# Altium schematic sheet Processing-Section.SchDoc
size A4; DocumentNumber: 2; SheetNumber: 2; SheetTotal: 8
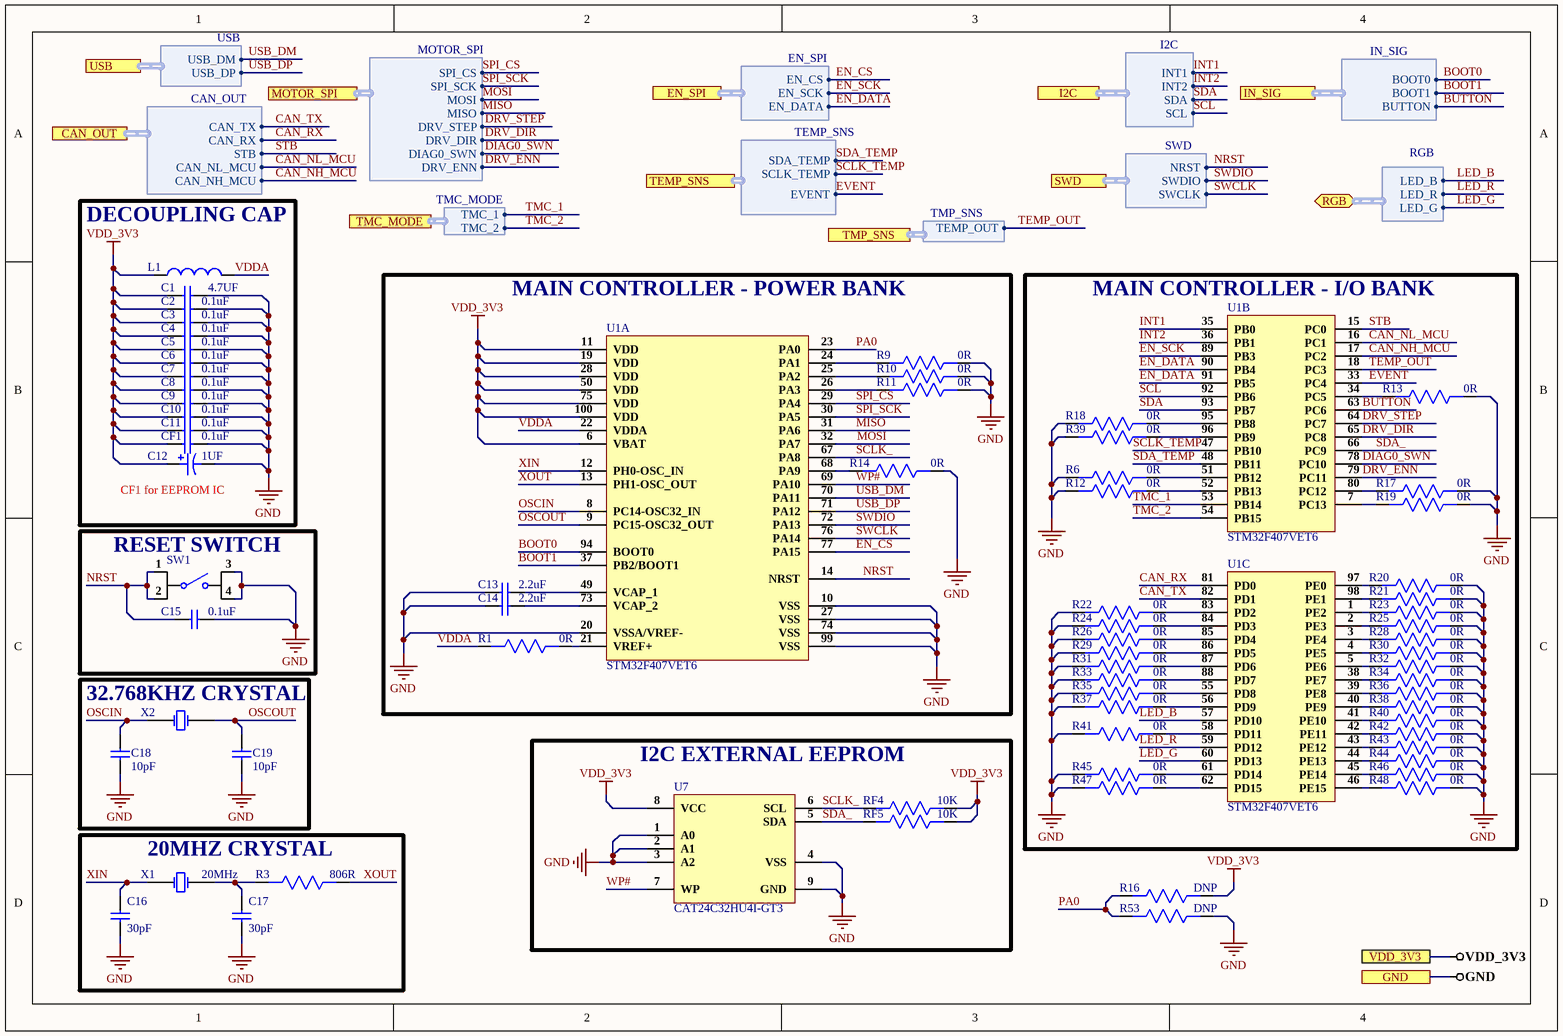
[diagram p0: Processing-Section.SchDoc]

## Parts
C1  4.7UF  [Cap0603]
C2  0.1uF  [Cap0603]
C3  0.1uF  [Cap0603]
C4  0.1uF  [Cap0603]
C5  0.1uF  [Cap0603]
C6  0.1uF  [Cap0603]
C7  0.1uF  [Cap0603]
C8  0.1uF  [Cap0603]
C9  0.1uF  [Cap0603]
C10  0.1uF  [Cap0603]
C11  0.1uF  [Cap0603]
C12  1UF  [CAP-CASE A]
C13  2.2uF  [Cap 0603]
C14  2.2uF  [Cap 0603]
C15  0.1uF  [Cap0603]
C16  30pF  [Cap 0603]
C17  30pF  [Cap 0603]
C18  10pF  [CAP 0201]
C19  10pF  [CAP 0201]
CF1  0.1uF  [Cap 0603]
L1  FBMH1608HL121-TV  [IND 0603]  (value not drawn)
R1  0R  [Res-0201]
R3  806R  [Res-0201]
R6  0R  [Res-0201]
R9  0R  [Res-0201]
R10  0R  [Res-0201]
R11  0R  [Res-0201]
R12  0R  [Res-0201]
R13  0R  [Res-0201]
R14  0R  [Res-0201]
R16  DNP  [Res0603]
R17  0R  [Res-0201]
R18  0R  [Res-0201]
R19  0R  [Res-0201]
R20  0R  [Res-0201]
R21  0R  [Res-0201]
R22  0R  [Res-0201]
R23  0R  [Res-0201]
R24  0R  [Res-0201]
R25  0R  [Res-0201]
R26  0R  [Res-0201]
R28  0R  [Res-0201]
R29  0R  [Res-0201]
R30  0R  [Res-0201]
R31  0R  [Res-0201]
R32  0R  [Res-0201]
R33  0R  [Res-0201]
R34  0R  [Res-0201]
R35  0R  [Res-0201]
R36  0R  [Res-0201]
R37  0R  [Res-0201]
R38  0R  [Res-0201]
R39  0R  [Res-0201]
R40  0R  [Res-0201]
R41  0R  [Res-0201]
R42  0R  [Res-0201]
R43  0R  [Res-0201]
R44  0R  [Res-0201]
R45  0R  [Res-0201]
R46  0R  [Res-0201]
R47  0R  [Res-0201]
R48  0R  [Res-0201]
R53  DNP  [Res0603]
RF4  10K  [Res0603]
RF5  10K  [Res0603]
SW1  GT-TC025D-H0065-L1  [GT-TC025D-H0065-L1]  (value not drawn)
U1  STM32F407VET6  [LQFP-100]  (parts A,B,C of 3)
U7  CAT24C32HU4I-GT3  [8-UDFN-EP (2x3)]
X1  20MHz  [HCM4920000000ABJT]
X2  ECS-.327-7-34B-C-TR  [ECS-.327-7-34B-C-TR]  (value not drawn)

## Blocks framed on the sheet
DECOUPLING CAP: C1-C12 CF1 L1
MAIN CONTROLLER - POWER BANK: C13 C14 R1 R9-R11 R14 U1
MAIN CONTROLLER - I/O BANK: R6 R12 R13 R17-R26 R28-R48 U1
RESET SWITCH: C15 SW1
32.768KHZ CRYSTAL: C18 C19 X2
I2C EXTERNAL EEPROM: RF4 RF5 U7
20MHZ CRYSTAL: C16 C17 R3 X1

## Ports
CAN_OUT (harness CAN_OUT), EN_SPI (harness EN_SPI), GND, I2C (harness I2C), IN_SIG (harness IN_SIG), MOTOR_SPI (harness MOTOR_SPI), RGB (bidir, harness RGB), SWD (harness SWD), TEMP_SNS (harness TEMP_SNS), TMC_MODE (harness TMC_MODE), TMP_SNS (harness TMP_SNS), USB (harness USB), VDD_3V3

## Harnesses
USB: USB_DM, USB_DP
MOTOR_SPI: SPI_CS, SPI_SCK, MOSI, MISO, DRV_STEP, DRV_DIR, DRV_ENN, DIAG0_SWN
I2C: INT1, INT2, SDA, SCL
TEMP_SNS: EVENT, SDA_TEMP, SCLK_TEMP
SWD: NRST, SWDIO, SWCLK
CAN_OUT: CAN_TX, CAN_RX, STB, CAN_NL_MCU, CAN_NH_MCU
TMC_MODE: TMC_1, TMC_2
IN_SIG: BOOT0, BUTTON, BOOT1
RGB: LED_R, LED_G, LED_B
EN_SPI: EN_CS, EN_SCK, EN_DATA
TMP_SNS: TEMP_OUT

## Nets
GND: C1.2 C2.2 C3.2 C4.2 C5.2 C6.2 C7.2 C8.2 C9.2 C10.2 C11.2 C12.2 C13.1 C14.1 C15.2 C16.1 C17.1 C18.1 C19.1 CF1.2 R6.2 R9.1 R10.1 R11.1 R12.2 R13.1 R14.1 R17.1 R18.2 R19.1 R20.1 R21.1 R22.2 R23.1 R24.2 R25.1 R26.2 R28.1 R29.2 R30.1 R31.2 R32.1 R33.2 R34.1 R35.2 R36.1 R37.2 R38.1 R39.2 R40.1 R41.2 R42.1 R43.1 R44.1 R45.2 R46.1 R47.2 R48.1 R53.1 SW1.3 SW1.4 U1.10(VSS) U1.20(VSSA/VREF-) U1.27(VSS) U1.74(VSS) U1.99(VSS) U7.1(A0) U7.2(A1) U7.3(A2) U7.4(VSS) U7.9(GND) ; port GND
VDD_3V3: C1.1 C2.1 C3.1 C4.1 C5.1 C6.1 C7.1 C8.1 C9.1 C10.1 C11.1 C12.1 CF1.1 L1.1 R16.1 RF4.1 RF5.1 U1.6(VBAT) U1.11(VDD) U1.19(VDD) U1.28(VDD) U1.50(VDD) U1.75(VDD) U1.100(VDD) U7.8(VCC) ; port VDD_3V3
BOOT0: U1.94(BOOT0) ; port IN_SIG.BOOT0
BOOT1: U1.37(PB2/BOOT1) ; port IN_SIG.BOOT1
BUTTON: U1.63(PC6) ; port IN_SIG.BUTTON
CAN_NH_MCU: U1.17(PC2) ; port CAN_OUT.CAN_NH_MCU
CAN_NL_MCU: U1.16(PC1) ; port CAN_OUT.CAN_NL_MCU
CAN_RX: U1.81(PD0) ; port CAN_OUT.CAN_RX
CAN_TX: U1.82(PD1) ; port CAN_OUT.CAN_TX
DIAG0_SWN: U1.78(PC10) ; port MOTOR_SPI.DIAG0_SWN
DRV_DIR: U1.65(PC8) ; port MOTOR_SPI.DRV_DIR
DRV_ENN: U1.79(PC11) ; port MOTOR_SPI.DRV_ENN
DRV_STEP: U1.64(PC7) ; port MOTOR_SPI.DRV_STEP
EN_CS: U1.77(PA15) ; port EN_SPI.EN_CS
EN_DATA: U1.90(PB4) U1.91(PB5) ; port EN_SPI.EN_DATA
EN_SCK: U1.89(PB3) ; port EN_SPI.EN_SCK
EVENT: U1.33(PC4) ; port TEMP_SNS.EVENT
INT1: U1.35(PB0) ; port I2C.INT1
INT2: U1.36(PB1) ; port I2C.INT2
LED_B: U1.57(PD10) ; port RGB.LED_B
LED_G: U1.60(PD13) ; port RGB.LED_G
LED_R: U1.59(PD12) ; port RGB.LED_R
MISO: U1.31(PA6) ; port MOTOR_SPI.MISO
MOSI: U1.32(PA7) ; port MOTOR_SPI.MOSI
NRST: C15.1 SW1.1 SW1.2 U1.14(NRST) ; port SWD.NRST
OSCIN: C18.2 U1.8(PC14-OSC32_IN) X2.1(OSC1)
OSCOUT: C19.2 U1.9(PC15-OSC32_OUT) X2.2(OSC2)
PA0: R16.2 R53.2 U1.23(PA0)
SCL: U1.92(PB6) ; port I2C.SCL
SCLK_: RF4.2 U1.67(PA8) U7.6(SCL)
SCLK_TEMP: U1.47(PB10) ; port TEMP_SNS.SCLK_TEMP
SDA: U1.93(PB7) ; port I2C.SDA
SDA_: RF5.2 U1.66(PC9) U7.5(SDA)
SDA_TEMP: U1.48(PB11) ; port TEMP_SNS.SDA_TEMP
SPI_CS: U1.29(PA4) ; port MOTOR_SPI.SPI_CS
SPI_SCK: U1.30(PA5) ; port MOTOR_SPI.SPI_SCK
STB: U1.15(PC0) ; port CAN_OUT.STB
SWCLK: U1.76(PA14) ; port SWD.SWCLK
SWDIO: U1.72(PA13) ; port SWD.SWDIO
TEMP_OUT: U1.18(PC3) ; port TMP_SNS.TEMP_OUT
TMC_1: U1.53(PB14) ; port TMC_MODE.TMC_1
TMC_2: U1.54(PB15) ; port TMC_MODE.TMC_2
USB_DM: U1.70(PA11) ; port USB.USB_DM
USB_DP: U1.71(PA12) ; port USB.USB_DP
VDDA: L1.2 R1.2 U1.22(VDDA)
WP#: U1.69(PA10) U7.7(WP)
XIN: C16.2 U1.12(PH0-OSC_IN) X1.1(OSC1)
XOUT: R3.1 U1.13(PH1-OSC_OUT)
NetC13_2: C13.2 U1.49(VCAP_1)
NetC14_2: C14.2 U1.73(VCAP_2)
NetC17_2: C17.2 R3.2 X1.2(OSC2)
NetR1_1: R1.1 U1.21(VREF+)
NetR6_1: R6.1 U1.51(PB12)
NetR9_2: R9.2 U1.24(PA1)
NetR10_2: R10.2 U1.25(PA2)
NetR11_2: R11.2 U1.26(PA3)
NetR12_1: R12.1 U1.52(PB13)
NetR13_2: R13.2 U1.34(PC5)
NetR14_2: R14.2 U1.68(PA9)
NetR17_2: R17.2 U1.80(PC12)
NetR18_1: R18.1 U1.95(PB8)
NetR19_2: R19.2 U1.7(PC13)
NetR20_2: R20.2 U1.97(PE0)
NetR21_2: R21.2 U1.98(PE1)
NetR22_1: R22.1 U1.83(PD2)
NetR23_2: R23.2 U1.1(PE2)
NetR24_1: R24.1 U1.84(PD3)
NetR25_2: R25.2 U1.2(PE3)
NetR26_1: R26.1 U1.85(PD4)
NetR28_2: R28.2 U1.3(PE4)
NetR29_1: R29.1 U1.86(PD5)
NetR30_2: R30.2 U1.4(PE5)
NetR31_1: R31.1 U1.87(PD6)
NetR32_2: R32.2 U1.5(PE6)
NetR33_1: R33.1 U1.88(PD7)
NetR34_2: R34.2 U1.38(PE7)
NetR35_1: R35.1 U1.55(PD8)
NetR36_2: R36.2 U1.39(PE8)
NetR37_1: R37.1 U1.56(PD9)
NetR38_2: R38.2 U1.40(PE9)
NetR39_1: R39.1 U1.96(PB9)
NetR40_2: R40.2 U1.41(PE10)
NetR41_1: R41.1 U1.58(PD11)
NetR42_2: R42.2 U1.42(PE11)
NetR43_2: R43.2 U1.43(PE12)
NetR44_2: R44.2 U1.44(PE13)
NetR45_1: R45.1 U1.61(PD14)
NetR46_2: R46.2 U1.45(PE14)
NetR47_1: R47.1 U1.62(PD15)
NetR48_2: R48.2 U1.46(PE15)

## Notes on the sheet
- (near C12) CF1 for EEPROM IC

## Library data of the parts
C1 = CL10A475KA8NQNC: CAP CER 4.7UF 25V X5R 0603; Manufacturer: Samsung; Tolerance: 10%; Supplier 1: Digi-Key; Manufacturer Part Number: CL10A475KA8NQNC; Stock 1: 2252340; Pricing 1: 1=0.37, 10=0.255, 100=0.1528, 500=0.11456, 1000=0.09675 (USD); Mount: Surface Mount; Case/Package: 0603; Case Code (Metric): 1608; Case Code (Imperial): 0603; Contact Plating: Tin; Min Operating Temperature: -55°C; Max Operating Temperature: 85°C; Package Quantity: 1; Packaging: Tape and Reel; Capacitance: 4.7uF; Voltage Rating: 25V; Dielectric: X5R; Termination: Wraparound; Length: 1.6mm; Width: 0.031inch; Thickness: 0.035inch; Depth: 0.8mm; Lead Free: Lead Free; ComponentLink1URL: http://www.samsungsem.com/kr/support/product-search/mlcc/CL10A475KA8NQNC.jsp?src-supplier=Digi-Key; ComponentLink1Description: http://www.samsungsem.com/kr/support/product-search/mlcc/CL10A475KA8NQNC.jsp?src-supplier=Digi-Key; Supplier Part Number 1: 1276-1900-1-ND
C2-C11 C15 CF1 = CL10B104KB8NNNC: Cap Ceramic 0.1uF 50VDC X7R 10% SMD 0603 Paper T/R; Manufacturer: Samsung; Capacitance: 100nF; Voltage Rating: 50V; Supplier 1: Digi-Key; Manufacturer Part Number: CL10B104KB8NNNC; RoHS: Yes; Category: Ceramic Capacitors; Stock 1: 3998791; Pricing 1: 1=0.10000, 10=0.03000, 50=0.01640, 100=0.01340, 500=0.00954, 1000=0.00750 (USD); Mount: Surface Mount; Case/Package: 0603; Case Code (Metric): 1608; Case Code (Imperial): 0603; Material: Ceramic; Contact Plating: Tin; Min Operating Temperature: -55°C; Max Operating Temperature: 125°C; Dielectric: X7R; Tolerance: 10%; Package Quantity: 1; Packaging: Tape and Reel; Voltage: 50V; Voltage Rating (DC): 50V; Series: CL; Construction: Flat; Length: 1.6mm; Width: 0.031inch; Height: 0.8mm; Depth: 0.8mm; Thickness: 0.035inch; Radiation Hardening: No; Lead Free: Lead Free; RoHS Compliant: Yes; ComponentLink1URL: https://datasheet.ciiva.com/25803/cl10b104kb8nnnc-25803393.pdf?src-supplier=Digi-Key; ComponentLink1Description: https://datasheet.ciiva.com/25803/cl10b104kb8nnnc-25803393.pdf?src-supplier=Digi-Key; ComponentLink2URL: https://datasheet.ciiva.com/26838/getdatasheetpartid-89097-26838411.pdf?src-supplier=Verical; ComponentLink2Description: https://datasheet.ciiva.com/26838/getdatasheetpartid-89097-26838411.pdf?src-supplier=Verical; ComponentLink3URL: https://datasheet.ciiva.com/29198/456651-da-01-en-vs-kondensator-0605-29198839.pdf?src-supplier=Conrad; ComponentLink3Description: https://datasheet.ciiva.com/29198/456651-da-01-en-vs-kondensator-0605-29198839.pdf?src-supplier=Conrad; Supplier Part Number 1: 1276-1000-1-ND
C12 = TAJA105K016RNJ: CAP TANT 1UF 10% 16V 1206; Manufacturer: Kyocera AVX; Dielectric Material: Tantalum; Tolerance: 20%; ESR (Equivalent Series Resistance): 11R; Polarity: Polar; Leakage Current: 500nA; Dissipation Factor: 4%; Supplier 1: Arrow Electronics; Manufacturer Part Number: TAJA105K016RNJ; RoHS: Yes; Category: Tantalum Capacitors; Stock 1: 1933; Pricing 1: 1=0.35550, 10=0.26530, 25=0.25530, 100=0.16440, 250=0.14790, 500=0.10860, 1000=0.10750 (USD); Mount: Surface Mount,PCB; Case/Package: 1206; Number of Pins: 2; Case Code (Metric): 3216; Case Code (Imperial): 1206; Weight: 0.000571oz; Min Operating Temperature: -55°C; Max Operating Temperature: 125°C; Capacitance: 1uF; Voltage Rating (DC): 16V; Packaging: Tape and Reel; Package Quantity: 1; Voltage Rating: 16V; Termination: SMD/SMT; Voltage: 16V; Features: General Purpose; Series: TAJ; Length: 3.2mm; Width: 1.6mm; Height: 1.6mm; Height - Seated (Max): 0.071inch; Depth: 1.6mm; Lead Pitch: 1.1mm; Radiation Hardening: No; REACH SVHC: No SVHC; Lead Free: Lead Free; RoHS Compliant: Yes; ComponentLink1URL: https://datasheet.ciiva.com/18710/taj-eng-18710647.pdf?src-supplier=Distrelec; ComponentLink1Description: https://datasheet.ciiva.com/18710/taj-eng-18710647.pdf?src-supplier=Distrelec; ComponentLink2URL: https://datasheet.ciiva.com/7832/taj-7832811.pdf?src-supplier=Element14; ComponentLink2Description: https://datasheet.ciiva.com/7832/taj-7832811.pdf?src-supplier=Element14; ComponentLink3URL: https://datasheet.ciiva.com/7832/taj-7832810.pdf?src-supplier=Element14; ComponentLink3Description: https://datasheet.ciiva.com/7832/taj-7832810.pdf?src-supplier=Element14; ComponentLink4URL: https://datasheet.ciiva.com/7832/1680476-7832431.pdf?src-supplier=Element14; ComponentLink4Description: https://datasheet.ciiva.com/7832/1680476-7832431.pdf?src-supplier=Element14; ComponentLink5URL: https://datasheet.ciiva.com/263/taj-263410.pdf?src-supplier=Digi-Key; ComponentLink5Description: https://datasheet.ciiva.com/263/taj-263410.pdf?src-supplier=Digi-Key; ComponentLink6URL: https://datasheet.ciiva.com/263/taj-263409.pdf?src-supplier=Digi-Key; ComponentLink6Description: https://datasheet.ciiva.com/263/taj-263409.pdf?src-supplier=Digi-Key; ComponentLink7URL: https://datasheet.ciiva.com/263/taj-263411.pdf?src-supplier=Digi-Key; ComponentLink7Description: https://datasheet.ciiva.com/263/taj-263411.pdf?src-supplier=Digi-Key; ComponentLink8URL: https://datasheet.ciiva.com/7832/1703059-7832429.pdf?src-supplier=Element14; ComponentLink8Description: https://datasheet.ciiva.com/7832/1703059-7832429.pdf?src-supplier=Element14; ComponentLink9URL: https://datasheet.ciiva.com/7832/1703059-7832430.pdf?src-supplier=Element14; ComponentLink9Description: https://datasheet.ciiva.com/7832/1703059-7832430.pdf?src-supplier=Element14; Supplier Part Number 1: TAJA105K016RNJ
C13 C14 = GRM188R6YA225KA12D: CAP, 2.2µF, 35V, 10%, X5R, 0603; Manufacturer: Murata; Material: Ceramic; Supplier 1: Digi-Key; Manufacturer Part Number: GRM188R6YA225KA12D; RoHS: Yes; Category: Ceramic Capacitors; Stock 1: 81665; Pricing 1: 1=0.21000, 10=0.14100, 50=0.08480, 100=0.07170, 500=0.04904, 1000=0.04338 (USD); Mount: Surface Mount; Case/Package: 0603; Case Code (Metric): 1608; Case Code (Imperial): 0603; Weight: 0.000222oz; Min Operating Temperature: -55°C; Max Operating Temperature: 85°C; Package Quantity: 4000; Packaging: Tape and Reel; Capacitance: 2.2uF; Tolerance: 10%; Voltage Rating: 35V; Dielectric: X5R; Voltage: 35V; Termination: SMD/SMT; Voltage Rating (DC): 35V; Series: GRM; Length: 1.6mm; Width: 0.8mm; Height: 0.8mm; Thickness: 0.035inch; Depth: 0.8mm; REACH SVHC: No SVHC; Lead Free: Lead Free; RoHS Compliant: Yes; ComponentLink1URL: https://datasheet.ciiva.com/14906/partnumbering-e-01-14906490.pdf?src-supplier=Digi-Key; ComponentLink1Description: https://datasheet.ciiva.com/14906/partnumbering-e-01-14906490.pdf?src-supplier=Digi-Key; ComponentLink2URL: https://datasheet.ciiva.com/14906/partnumbering-e-01-14906491.pdf?src-supplier=Digi-Key; ComponentLink2Description: https://datasheet.ciiva.com/14906/partnumbering-e-01-14906491.pdf?src-supplier=Digi-Key; ComponentLink3URL: https://datasheet.ciiva.com/14906/partnumbering-e-01-14906492.pdf?src-supplier=Digi-Key; ComponentLink3Description: https://datasheet.ciiva.com/14906/partnumbering-e-01-14906492.pdf?src-supplier=Digi-Key; Supplier Part Number 1: 490-7204-1-ND
C16 C17 = CC0603JRNPO9BN300: CAP 30pF NP0 0603 50 V ±5 % SMD; Manufacturer: Yageo; Tolerance: 5%; Dielectric: C0G; Voltage Rating: 50V; Dissipation Factor: 0.1%; Insulation Resistance: 10GR; Supplier 1: Digi-Key; Manufacturer Part Number: CC0603JRNPO9BN300; RoHS: Yes; Category: Ceramic Capacitors; Stock 1: 36700; Pricing 1: 1=0.10000, 10=0.06800, 50=0.03700, 100=0.03020, 500=0.02160, 1000=0.01697 (USD); Mount: Surface Mount; Case/Package: 0603; Number of Pins: 2; Case Code (Imperial): 0603; Case Code (Metric): 1608; Weight: 7.1E-05oz; Min Operating Temperature: -55°C; Max Operating Temperature: 125°C; Capacitance: 30pF; Packaging: Tape and Reel; Voltage Rating (DC): 50V; Termination: SMD/SMT; Resistor Type: Ceramic; Series: CC; Construction: Flat; Length: 1.6mm; Width: 0.031inch; Height: 0.8mm; Thickness: 0.035inch; Depth: 0.8mm; Radiation Hardening: No; REACH SVHC: No SVHC; Lead Free: Lead Free; RoHS Compliant: Yes; ComponentLink1URL: https://datasheet.ciiva.com/26862/getdatasheetpartid-403531-26862766.pdf?src-supplier=Verical; ComponentLink1Description: https://datasheet.ciiva.com/26862/getdatasheetpartid-403531-26862766.pdf?src-supplier=Verical; ComponentLink2URL: https://datasheet.ciiva.com/13264/upy-gp-np0-16v-to-50v-8-3714-13264406.pdf?src-supplier=Mouser; ComponentLink2Description: https://datasheet.ciiva.com/13264/upy-gp-np0-16v-to-50v-8-3714-13264406.pdf?src-supplier=Mouser; ComponentLink3URL: https://datasheet.ciiva.com/7978/1132289-7978140.pdf?src-supplier=Element14; ComponentLink3Description: https://datasheet.ciiva.com/7978/1132289-7978140.pdf?src-supplier=Element14; ComponentLink4URL: https://datasheet.ciiva.com/28450/1443161-28450494.pdf?src-supplier=Element14; ComponentLink4Description: https://datasheet.ciiva.com/28450/1443161-28450494.pdf?src-supplier=Element14; Supplier Part Number 1: 311-3357-1-ND
C18 C19 = CGA1A2C0G1E100D030BA: CAP CER 10PF 25V C0G 0201; Manufacturer: TDK; Supplier 1: Digi-Key; Manufacturer Part Number: CGA1A2C0G1E100D030BA; RoHS: Yes; Category: Ceramic Capacitors; Stock 1: 28695; Pricing 1: 1=0.11000, 10=0.07900, 50=0.04340, 100=0.03540, 500=0.02530, 1000=0.01987, 2500=0.01807, 5000=0.01662 (USD); Mount: Surface Mount; Case/Package: 0201; Case Code (Imperial): 0201; Case Code (Metric): 0603; Weight: 6E-06oz; Min Operating Temperature: -55°C; Max Operating Temperature: 125°C; Packaging: Tape and Reel; Capacitance: 10pF; Voltage Rating: 25V; Termination: SMD/SMT; Voltage Rating (DC): 25V; Package Quantity: 1; Dielectric: C0G; Resistor Type: Ceramic; Series: CGA; Length: 0.6mm; Width: 0.3mm; Height: 0.3mm; Thickness: 0.013inch; Depth: 0.3mm; Ratings: AEC-Q200; RoHS Compliant: Yes; ComponentLink1URL: https://datasheet.ciiva.com/24220/cga1a2c0g1e100d030ba-271838-24220873.pdf?src-supplier=Mouser; ComponentLink1Description: https://datasheet.ciiva.com/24220/cga1a2c0g1e100d030ba-271838-24220873.pdf?src-supplier=Mouser; Supplier Part Number 1: 445-9023-1-ND
L1 = FBMH1608HL121-TV: Ferrite Beads 120Ohm 25% 100MHz 1.2A 0.13Ohm DCR 0603 Automotive T/R; Manufacturer: Taiyo Yuden; Impedance: 120R; Number of Lines: 1; DC Resistance (DCR): 130mR; Max DC Current: 900mA; Supplier 1: Avnet; Manufacturer Part Number: FBMH1608HL121-TV; RoHS: Yes; Category: Ferrite Beads and Chips; Pricing 1: 4000=0.05939, 8000=0.05429, 16000=0.05185, 24000=0.04942, 32000=0.04698 (USD); Mount: Surface Mount; Case/Package: 0603; Core Material: Ferrite; Case Code (Metric): 1608; Case Code (Imperial): 0603; Weight: 7.1E-05oz; Min Operating Temperature: -40°C; Max Operating Temperature: 125°C; Tolerance: 25%; Package Quantity: 4000; Packaging: Tape and Reel; Max Current Rating: 1.2A; Termination: SMD/SMT; Test Frequency: 100MHz; Length: 0.063inch; Width: 0.8mm; Height: 0.8mm; Ratings: AEC-Q200; RoHS Compliant: Yes; ComponentLink1URL: http://www.mouser.com/ds/2/396/chipbeads01_e-559265.pdf?src-supplier=Mouser; ComponentLink1Description: http://www.mouser.com/ds/2/396/chipbeads01_e-559265.pdf?src-supplier=Mouser; ComponentLink2URL: http://ds.yuden.co.jp/TYCOMPAS/ut/detail.do?productNo=FBMH1608HL121-TV&fileName=FBMH1608HL121-TV_SS&mode=specSheetDownload&src-supplier=Digi-Key; ComponentLink2Description: http://ds.yuden.co.jp/TYCOMPAS/ut/detail.do?productNo=FBMH1608HL121-TV&fileName=FBMH1608HL121-TV_SS&mode=specSheetDownload&src-supplier=Digi-Key; ComponentLink3URL: https://www.yuden.co.jp/ut/product/category/emisuppression/FBMH1608HL121-TV_SS.pdf?src-supplier=Avnet; ComponentLink3Description: https://www.yuden.co.jp/ut/product/category/emisuppression/FBMH1608HL121-TV_SS.pdf?src-supplier=Avnet; Supplier Part Number 1: FBMH1608HL121-TV
R1 R6 R9-R14 R17-R26 R28-R48 = RC0201JR-070RL: RES SMD 0 OHM JUMPER 1/20W 0201; Manufacturer: Yageo; Power Rating: 50mW; Tolerance: 5%; Voltage Rating: 25V; Supplier 1: Digi-Key; Manufacturer Part Number: RC0201JR-070RL; RoHS: Yes; Category: Chip SMD Resistors; Stock 1: 11079; Pricing 1: 1=0.10000, 10=0.03600, 25=0.02640, 50=0.02000, 100=0.01480, 250=0.01128, 500=0.00904, 1000=0.00665, 5000=0.00477 (USD); Case/Package: 0201; Contact Plating: Tin,Matte; Case Code (Metric): 0603; Case Code (Imperial): 0201; Weight: 6E-06oz; Size Code: 0201; Min Operating Temperature: -55°C; Max Operating Temperature: 125°C; Resistor Type: Thick Film; Resistance: 0R; Packaging: Tape and Reel; Package Quantity: 10000; Number of Terminations: 2; Termination: SMD/SMT; Max Power Dissipation: 50mW; Voltage Rating (DC): 25V; Features: Moisture Resistant; Series: RC; Construction: Rectangular; Resistance Tolerance: 5%; Length: 0.6mm; Width: 0.012inch; Height: 0.01inch; Depth: 0.3mm; Radiation Hardening: No; RoHS Compliant: Yes; REACH SVHC: Unknown; Military Standard: Not; Lead Free: Lead Free; ComponentLink1URL: https://datasheet.ciiva.com/7672/1563626-7672247.pdf?src-supplier=Element14; ComponentLink1Description: https://datasheet.ciiva.com/7672/1563626-7672247.pdf?src-supplier=Element14; ComponentLink2URL: https://datasheet.ciiva.com/7660/1421516-7660808.pdf?src-supplier=Element14; ComponentLink2Description: https://datasheet.ciiva.com/7660/1421516-7660808.pdf?src-supplier=Element14; ComponentLink3URL: https://datasheet.ciiva.com/7672/1563626-7672248.pdf?src-supplier=Element14; ComponentLink3Description: https://datasheet.ciiva.com/7672/1563626-7672248.pdf?src-supplier=Element14; ComponentLink4URL: https://datasheet.ciiva.com/16855/pyu-rc0201-51-rohs-l-8-16855994.pdf?src-supplier=Avnet+Europe; ComponentLink4Description: https://datasheet.ciiva.com/16855/pyu-rc0201-51-rohs-l-8-16855994.pdf?src-supplier=Avnet+Europe; ComponentLink5URL: https://datasheet.ciiva.com/28419/pyu-rc0201-51-rohs-l-8-28419660.pdf?src-supplier=Avnet+Europe; ComponentLink5Description: https://datasheet.ciiva.com/28419/pyu-rc0201-51-rohs-l-8-28419660.pdf?src-supplier=Avnet+Europe; ComponentLink6URL: https://datasheet.ciiva.com/46391/1421516-46391340.pdf?src-supplier=Element14; ComponentLink6Description: https://datasheet.ciiva.com/46391/1421516-46391340.pdf?src-supplier=Element14; ComponentLink7URL: https://datasheet.ciiva.com/8896/pyu-rc0201-51-rohs-l-8-8896143.pdf?src-supplier=Avnet; ComponentLink7Description: https://datasheet.ciiva.com/8896/pyu-rc0201-51-rohs-l-8-8896143.pdf?src-supplier=Avnet; Supplier Part Number 1: 311-0.0NCT-ND
R3 = RMCF0201FT806R: Res Thick Film 0201 806 Ohm 1% 1/20W ±200ppm/°C Molded SMD SMD Paper T/R; Manufacturer: Stackpole Electronics; Max Power Dissipation: 50mW; Supplier 1: Digi-Key; Manufacturer Part Number: RMCF0201FT806R; RoHS: Yes; Category: Chip SMD Resistors; Stock 1: 9465; Pricing 1: 1=0.10000, 10=0.02700, 100=0.01090, 1000=0.00488, 2500=0.00423, 5000=0.00350 (USD); Mount: Surface Mount; Case/Package: 0201; Case Code (Metric): 0603; Case Code (Imperial): 0201; Contact Plating: Tin,Matte; Min Operating Temperature: -55°C; Max Operating Temperature: 125°C; Packaging: Tape and Reel; Resistance: 806R; Tolerance: 1%; Resistor Type: Thick Film; Number of Terminations: 2; Package Quantity: 10000; Temperature Coefficient: 200ppm/°C; Series: RMCF; Length: 0.024inch; Width: 0.012inch; Height: 0.009inch; Radiation Hardening: No; RoHS Compliant: Yes; ComponentLink1URL: https://www.seielect.com/catalog/SEI-RMCF_RMCP.pdf?src-supplier=Avnet; ComponentLink1Description: https://www.seielect.com/catalog/SEI-RMCF_RMCP.pdf?src-supplier=Avnet; ComponentLink2URL: https://www.seielect.com/catalog/SEI-Packaging.pdf?src-supplier=Digi-Key; ComponentLink2Description: https://www.seielect.com/catalog/SEI-Packaging.pdf?src-supplier=Digi-Key; ComponentLink3URL: https://www.seielect.com/Catalog/SEI-RMCF_RMCP.pdf?src-supplier=Digi-Key; ComponentLink3Description: https://www.seielect.com/Catalog/SEI-RMCF_RMCP.pdf?src-supplier=Digi-Key; ComponentLink4URL: http://www.seielect.com/Catalog/SEI-RMCF_RMCP.pdf?src-supplier=Digi-Key; ComponentLink4Description: http://www.seielect.com/Catalog/SEI-RMCF_RMCP.pdf?src-supplier=Digi-Key; Supplier Part Number 1: RMCF0201FT806RCT-ND
R16 R53 RF4 RF5 = RC0603FR-0710KL: RES SMD 10K Ohm 1% 1/10W 0603; Manufacturer: Yageo; Resistance: 10kR; Temperature Coefficient: 100ppm/°C; Voltage Rating (DC): 50V; Power Rating: 100mW; Voltage Rating: 75V; Supplier 1: Digi-Key; Manufacturer Part Number: RC0603FR-0710KL; RoHS: Yes; Category: Chip SMD Resistors; Stock 1: 25249139; Pricing 1: 1=0.10000, 10=0.02400, 100=0.00970, 1000=0.00436, 2500=0.00378 (USD); Case/Package: 0603; Number of Pins: 2; Case Code (Imperial): 0603; Case Code (Metric): 1608; Weight: 7.1E-05oz; Size Code: 0603; Min Operating Temperature: -55°C; Max Operating Temperature: 155°C; Tolerance: 1%; Resistor Type: Thick Film; Packaging: Tape and Reel; Termination: SMD/SMT; Features: Moisture Resistant; Series: RC; Max Power Dissipation: 100mW; Number of Terminations: 2; Resistance Tolerance: 1%; Construction: Rectangular; Length: 1.6mm; Width: 0.8mm; Height: 0.45mm; Depth: 0.8mm; Lead Pitch: 0.3mm; REACH SVHC: Unknown; Lead Free: Lead Free; Military Standard: Not; RoHS Compliant: Yes; ComponentLink1URL: https://datasheet.ciiva.com/7660/38590-7660789.pdf?src-supplier=Element14; ComponentLink1Description: https://datasheet.ciiva.com/7660/38590-7660789.pdf?src-supplier=Element14; ComponentLink2URL: https://datasheet.ciiva.com/7983/443971-7983596.pdf?src-supplier=Element14; ComponentLink2Description: https://datasheet.ciiva.com/7983/443971-7983596.pdf?src-supplier=Element14; ComponentLink3URL: https://datasheet.ciiva.com/22747/443971-22747519.pdf?src-supplier=Element14; ComponentLink3Description: https://datasheet.ciiva.com/22747/443971-22747519.pdf?src-supplier=Element14; ComponentLink4URL: https://datasheet.ciiva.com/46440/1868787-46440891.pdf?src-supplier=Element14; ComponentLink4Description: https://datasheet.ciiva.com/46440/1868787-46440891.pdf?src-supplier=Element14; ComponentLink5URL: https://datasheet.ciiva.com/7746/1738695-7746239.pdf?src-supplier=Element14; ComponentLink5Description: https://datasheet.ciiva.com/7746/1738695-7746239.pdf?src-supplier=Element14; ComponentLink6URL: https://datasheet.ciiva.com/15189/getdatasheetpartid-409289-15189591.pdf?src-supplier=Verical; ComponentLink6Description: https://datasheet.ciiva.com/15189/getdatasheetpartid-409289-15189591.pdf?src-supplier=Verical; Supplier Part Number 1: 311-10.0KHRCT-ND
SW1 = GT-TC025D-H0065-L1: No NO J pin 50mA 3mm 100MΩ 100000 12V 250gf@±30gf 2.6mm -30℃~+85℃ 0.65mm Black Round Button Brick nogging SPST SMD Tactile Switches ROHS; Manufacturer: G-Switch; ComponentLink1Description: LCSC; ComponentLink1URL: https://www.lcsc.com/product-detail/Tactile-Switches_G-Switch-GT-TC025D-H0065-L1_C778132.html; Manufacturer Part Number: GT-TC025D-H0065-L1
U1 = STM32F407VET6: IC MCU 32BIT 512KB FLASH 100LQFP; Manufacturer: STMicroelectronics; Frequency: 168MHz; Number of I/Os: 82; Interface: I2C,SPI,CAN,I2S,UART,USB,Ethernet,IrDA,USART,LIN,EBI/EMI; Oscillator Type: Internal; Peripherals: Brown-out Detect/Reset,POR,PWM,WDT,DMA,LCD,I2C; Core Architecture: ARM; RAM Size: 196KB; Number of ADC Channels: 16; Number of Ethernet Channels: 1; Number of Timers/Counters: 14; Number of UART Channels: 2; Max Supply Voltage: 3.6V; Min Supply Voltage: 1.8V; Data Bus Width: 32b; Number of SPI Channels: 3; Watchdog Timer: Yes; Supplier 1: Newark; Manufacturer Part Number: STM32F407VET6; RoHS: Yes; Category: Microcontrollers; Pricing 1: 1=16.05000, 10=14.76000, 25=14.15000, 50=13.31000, 100=12.47000 (USD); Case/Package: LQFP; Number of Pins: 100; Min Operating Temperature: -40°C; Max Operating Temperature: 85°C; Packaging: Tray; Memory Type: FLASH; Memory Size: 512KB; Package Quantity: 90; Number of Programmable I/O: 82; Max Frequency: 168MHz; Number of I2C Channels: 3; Series: STM32 F4; Number of PWM Channels: 2; Length: 14.2mm; Width: 14.2mm; Height: 1.45mm; Radiation Hardening: No; RoHS Compliant: Yes; REACH SVHC: No SVHC; Lead Free: Lead Free; ComponentLink1URL: https://datasheet.ciiva.com/16330/dm00037051-16330920.pdf?src-supplier=Future+Electronics; ComponentLink1Description: https://datasheet.ciiva.com/16330/dm00037051-16330920.pdf?src-supplier=Future+Electronics; ComponentLink2URL: https://datasheet.ciiva.com/8055/1717982-8055038.pdf?src-supplier=Element14; ComponentLink2Description: https://datasheet.ciiva.com/8055/1717982-8055038.pdf?src-supplier=Element14; ComponentLink3URL: https://datasheet.ciiva.com/4837/dm00037051-492832-4837637.pdf?src-supplier=Mouser; ComponentLink3Description: https://datasheet.ciiva.com/4837/dm00037051-492832-4837637.pdf?src-supplier=Mouser; Supplier Part Number 1: 73T7121
U7 = CAT24C32HU4I-GT3: IC EEPROM 32KBIT I2C 1MHZ 8UDFN; Manufacturer: ON Semiconductor; Interface: I2C,Serial,2-Wire; Density: 32Kb; Max Supply Voltage: 5.5V; Min Supply Voltage: 1.7V; Number of Words: 4096; Access Time: 3500ns; Frequency: 100kHz; Nominal Supply Current: 2mA; Operating Supply Voltage: 5V; Organization: 4KX8; Access Time-Max: 900ns; Write Protection: YES; Supplier 1: Digi-Key; Manufacturer Part Number: CAT24C32HU4I-GT3; RoHS: Yes; Category: EEPROM; Stock 1: 5701; Pricing 1: 1=0.47000, 10=0.45700, 25=0.42440, 50=0.42220, 100=0.37490, 250=0.37012, 500=0.36452, 1000=0.35478 (USD); Mount: Surface Mount; Number of Pins: 8; Contact Plating: Gold; Min Operating Temperature: -40°C; Max Operating Temperature: 85°C; Packaging: Tape and Reel; Package Quantity: 3000; Memory Type: EEPROM; Memory Size: 32Kb; Max Frequency: 1MHz; Series: -; Supply Current: 2mA; Length: 3.05mm; Width: 2.05mm; Height: 0.5mm; Radiation Hardening: No; REACH SVHC: No SVHC; Lead Free: Lead Free; Halogen Free: Halogen Free; RoHS Compliant: Yes; ComponentLink1URL: https://datasheet.ciiva.com/15123/getdatasheetpartid-488928-15123672.pdf?src-supplier=Verical; ComponentLink1Description: https://datasheet.ciiva.com/15123/getdatasheetpartid-488928-15123672.pdf?src-supplier=Verical; ComponentLink2URL: https://datasheet.ciiva.com/1912/cat24c32-d-1912019.pdf?src-supplier=Digi-Key; ComponentLink2Description: https://datasheet.ciiva.com/1912/cat24c32-d-1912019.pdf?src-supplier=Digi-Key; ComponentLink3URL: https://datasheet.ciiva.com/9282/cat24c32-d-9282397.pdf?src-supplier=Avnet; ComponentLink3Description: https://datasheet.ciiva.com/9282/cat24c32-d-9282397.pdf?src-supplier=Avnet; ComponentLink4URL: https://datasheet.ciiva.com/22618/1696760-22618476.pdf?src-supplier=Element14; ComponentLink4Description: https://datasheet.ciiva.com/22618/1696760-22618476.pdf?src-supplier=Element14; Supplier Part Number 1: CAT24C32HU4I-GT3OSCT-ND
X1 = HCM4920000000ABJT: CRYSTAL 20.0000MHZ 18PF SMD; Manufacturer: CITIZEN; ackage: HCM-49SMD; Crystal Type: Passive SMD Crystal; Frequency Tolerance: 30ppm; ESR (Equivalent Series Resistance): 50R; Supplier 1: Digi-Key; Manufacturer Part Number: HCM4920000000ABJT; RoHS: Yes; Category: Crystals; Stock 1: 172067; Pricing 1: 1=0.60000, 10=0.50000, 50=0.45000, 100=0.40000, 500=0.38000 (USD); Mount: Surface Mount; Min Operating Temperature: -40°C; Max Operating Temperature: 85°C; Load Capacitance: 18pF; Frequency: 20MHz; Lead Free: Lead Free; RoHS Compliant: Yes; ComponentLink1URL: https://datasheet.ciiva.com/16207/hcm49-16207144.pdf?src-supplier=Future+Electronics; ComponentLink1Description: https://datasheet.ciiva.com/16207/hcm49-16207144.pdf?src-supplier=Future+Electronics; Supplier Part Number 1: 300-6142-1-ND
X2 = ECS-.327-7-34B-C-TR: Crystals 32.768KHz 7pF; Manufacturer: ECS International; ESR (Equivalent Series Resistance): 70kR; Frequency Tolerance: 10ppm; Supplier 1: Digi-Key; Manufacturer Part Number: ECS-.327-7-34B-C-TR; Stock 1: 27045; Pricing 1: 1=0.8, 10=0.708, 50=0.6622, 100=0.5852, 500=0.5544, 1000=0.462 (USD); Mount: Surface Mount; Case/Package: SMD/SMT; Number of Pins: 2; Min Operating Temperature: -40°C; Max Operating Temperature: 85°C; Frequency: 32.768kHz; Load Capacitance: 7pF; Package Quantity: 3000; Packaging: Tape and Reel; Termination: SMD/SMT; Frequency Stability: 10ppm; Length: 0.126inch; Height: 0.035inch; Width: 0.061inch; Lead Pitch: 2.4mm; ComponentLink1URL: https://datasheet.ciiva.com/12387/ecx-31b-15952-12387920.pdf; ComponentLink1Description: https://datasheet.ciiva.com/12387/ecx-31b-15952-12387920.pdf; ComponentLink2URL: https://datasheet.ciiva.com/15047/ecx-31b-15047071.pdf; ComponentLink2Description: https://datasheet.ciiva.com/15047/ecx-31b-15047071.pdf; Supplier Part Number 1: XC1948CT-ND